# EAGLE design HWProgUSB_DIP (EAGLE 6.3)
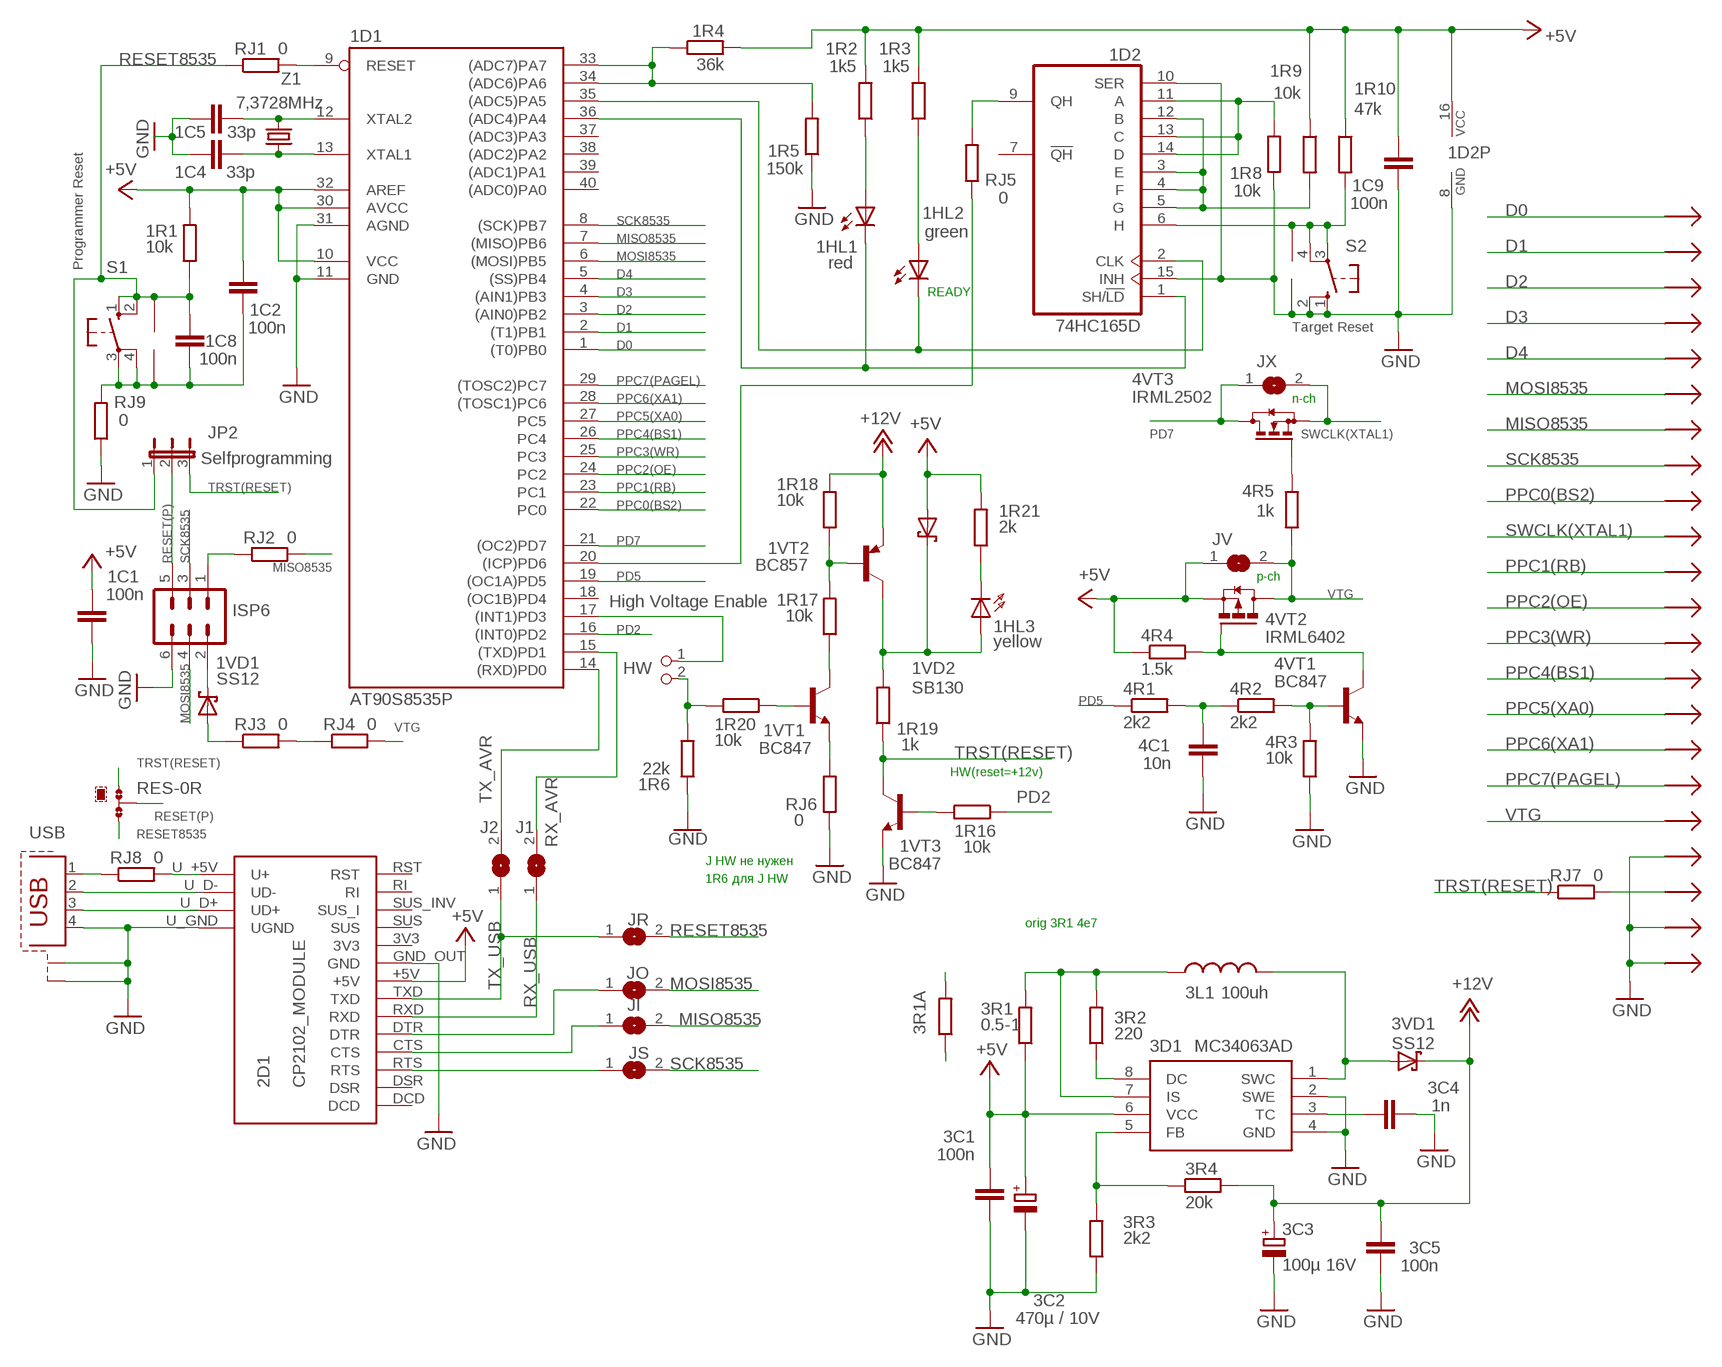
[diagram p0: schematic, sheet 1]

## Parts
1C1  100n  C-EUC0805  [C0805]
1C2  100n  C-EUC0805  [C0805]
1C4  33p  C-EUC0805  [C0805]
1C5  33p  C-EUC0805  [C0805]
1C8  100n  C-EUC0805  [C0805]
1C9  100n  C-EUC0805  [C0805]
1D1  AT90S8535P  [DIL40]
1D2  74HC165D  [SO16]
1HL1  red  LED5MM  [LED5MM]
1HL2  green  LED5MM  [LED5MM]
1HL3  yellow  LED5MM  [LED5MM]
1R1  10k  R-EU_M0805  [M0805]
1R2  1k5  R-EU_M0805  [M0805]
1R3  1k5  R-EU_M0805  [M0805]
1R4  36k  R-EU_M0805  [M0805]
1R5  150k  R-EU_R1206W  [R1206W]
1R6  22k  R-EU_M1206  [M1206]
1R8  10k  R-EU_M0805  [M0805]
1R9  10k  R-EU_R1206W  [R1206W]
1R10  47k  R-EU_M0805  [M0805]
1R16  10k  R-EU_R0805  [R0805]
1R17  10k  R-EU_M0805  [M0805]
1R18  10k  R-EU_M0805  [M0805]
1R19  1k  R-EU_M0805  [M0805]
1R20  10k  R-EU_M0805  [M0805]
1R21  2k  R-EU_R1206W  [R1206W]
1VD1  SS12  SCHOTTKY-DIODESMD  [SMB]
1VD2  SB130  SCHOTTKY-DIODESMD  [SMB]
1VT1  BC847  [SOT23]
1VT2  BC857  BC857A-PNP-SOT23-BEC  [SOT23-BEC]
1VT3  BC847  [SOT23]
2D1  CP2102_MODULE  [CP2102_MODULE]
3C1  100n  C-EU025-024X044  [C025-024X044]
3C2  470µ / 10V  RCL_CPOL-EUE3.5-8  [RCL_E3,5-8]
3C3  100µ 16V  RCL_CPOL-EUE3.5-8  [RCL_E3,5-8]
3C4  1n  C-EU025-025X050  [C025-025X050]
3C5  100n  C-EU025-025X050  [C025-025X050]
3D1  MC34063AD  [SOIC8]
3L1  100uh  L-US0207/10  [0207/10]
3R1  0.5-1  R-EU_0204/7  [0204/7]
3R1A  R-EU_0204/7  [0204/7]
3R2  220  R-EU_0204/7  [0204/7]
3R3  2k2  R-EU_M0805  [M0805]
3R4  20k  R-EU_M0805  [M0805]
3VD1  SS12  SCHOTTKY-DIODESMD  [SMB]
4C1  10n  C-EUC1206  [C1206]
4R1  2k2  R-EU_R1206W  [R1206W]
4R2  2k2  R-EU_M0805  [M0805]
4R3  10k  R-EU_M0805  [M0805]
4R4  1.5k  R-EU_M0805  [M0805]
4R5  1k  R-EU_M0805  [M0805]
4VT1  BC847  [SOT23]
4VT2  IRML6402  FDN360P  [SUPER-SOT3]
4VT3  IRML2502  BSS123  [SOT23]
HW  High Voltage Enable  PINHEAD_PINHD-1X2  [PINHEAD_1X02]
ISP6  MA03-2  [MA03-2]
J1  SJ  [SJ]
J2  SJ  [SJ]
JI  SJ  [SJ]
JO  SJ  [SJ]
JP2  Selfprogramming  JUMPER_JP2E  [JUMPER_JP2]
JR  SJ  [SJ]
JS  SJ  [SJ]
JV  SJ  [SJ]
JX  SJ  [SJ]
RES  0R-JUMPA  [A0R-JMP]
RJ1  0  R-EU_R1206  [R1206]
RJ2  0  R-EU_R1206  [R1206]
RJ3  0  R-EU_R1206  [R1206]
RJ4  0  R-EU_R1206  [R1206]
RJ5  0  R-EU_R1206W  [R1206W]
RJ6  0  R-EU_R1206  [R1206]
RJ7  0  R-EU_R1206  [R1206]
RJ8  0  R-EU_R1206  [R1206]
RJ9  0  R-EU_R1206  [R1206]
S1  10-XX  [B3F-10XX]
S2  10-XX  [B3F-10XX]
U$1  5.08  [KEY]
U$2  5.08  [KEY]
USB  PROGRAMMER_PN61729-S  [PROGRAMMER_PN61729-S]
X2  P_AVR_V  [CON-PCI]
Z1  7,3728MHz  CRYTALHC49U-V  [HC49U-V]

## Nets
+5V: 1C1.2 1C2.2 1C9.1 1D1.10(VCC) 1D1.30(AVCC) 1D1.32(AREF) 1D2.16(VCC) 1R1.2 1R2.2 1R3.2 1R4.2 1R9.1 1R10.1 1R21.2 1VD2.A 2D1.+5V 3C1.1 3C2.+ 3D1.6(VCC) 3R1.1 3R1A.1 4R4.1 4VT2.2(S) JV.1
+12V: 1R18.2 1VT2.E 3C3.+ 3C5.2 3R4.2 3VD1.C
D0: 1D1.1((T0)PB0) X2.1D0(D0) X2.2D0(D0)
D1: 1D1.2((T1)PB1) X2.1D1(D1) X2.2D1(D1)
D2: 1D1.3((AIN0)PB2) X2.1D2(D2) X2.2D2(D2)
D3: 1D1.4((AIN1)PB3) X2.1D3(D3) X2.2D3(D3)
D4: 1D1.5((SS)PB4) X2.1D4(D4) X2.2D4(D4)
GND: 1C1.1 1C4.1 1C5.1 1C9.2 1D1.31(AGND) 1D2.8(GND) 1D2.10(SER) 1D2.15(INH) 1R5.1 1R6.1 1R8.1 1VT3.2(E) 2D1.GND_OUT(GND) 2D1.U_GND(UGND) 3C1.2 3C2.- 3C3.- 3C4.2 3C5.1 3D1.2(SWE) 3D1.4(GND) 3R3.1 4C1.1 4R3.1 4VT1.2(E) ISP6.6 RJ6.1 RJ9.1 S2.1(S) S2.2(S1) U$2.P$1 USB.4 USB.S1 USB.S2 X2.0(GND) X2.1(GND) X2.1GND1(GND2) X2.1GND2(LGND) X2.2(GND) X2.2GND1(GND2) X2.2GND2(LGND) X2.3(GND) X2.4(GND) X2.5(GND) X2.6(GND) X2.7(GND) X2.8(GND) X2.9(GND) X2.10(GND) X2.11(GND) X2.12(GND) X2.13(GND) X2.14(GND) X2.15(GND) X2.16(GND) X2.17(GND) X2.18(GND) X2.19(GND) X2.20(GND) X2.21(GND) X2.22(GND) X2.23(GND) X2.24(GND) X2.25(GND) X2.26(GND) X2.27(GND) X2.28(GND) X2.29(GND) X2.30(GND) X2.31(GND) X2.32(GND) X2.33(GND) X2.34(GND) X2.35(GND) X2.36(GND) X2.37(GND) X2.38(GND) X2.39(GND) X2.40(GND) X2.41(GND)
MISO8535: 1D1.7((MISO)PB6) JI.2 RJ2.2 X2.1D6(D6) X2.2D6(D6)
MOSI8535: 1D1.6((MOSI)PB5) ISP6.4 JO.2 X2.1D5(D5) X2.2D5(D5)
N4: 1D1.36((ADC4)PA4) 1D2.1(SH/!LD) 1HL1.K(C)
N$1: RJ7.2 X2.1RESET(RESET) X2.2RESET(RESET)
N$2: 1D1.9(RESET) RJ1.2
N$3: ISP6.1 RJ2.1
N$4: 2D1.U_+5V(U+) RJ8.2
N$5: 1VT1.2(E) RJ6.2
N$6: 1VD1.C ISP6.2
N$7: 2D1.CTS JI.1
N$9: 1VD1.A RJ3.1
N$10: RJ3.2 RJ4.1
N$12: 1C5.2 1D1.12(XTAL2) Z1.2
N$13: 1C4.2 1D1.13(XTAL1) Z1.1
N$14: RJ8.1 USB.1
N$15: 1C2.1 1C8.1 RJ9.2 S1.3(P) S1.4(P1) U$1.P$1
N$20: 1HL3.K(C) 1R21.1
N$21: 4R5.2 4VT3.1(G)
N$22: 1D2.9(QH) RJ5.2
N$45: 2D1.U_D+(UD+) USB.3
N$46: 2D1.U_D-(UD-) USB.2
N$55: 4R2.2 4R3.2 4VT1.1(B)
N$59: 4R4.2 4VT1.3(C) 4VT2.1(G)
N$60: 2D1.RTS JS.1
N$62: 4C1.2 4R1.2 4R2.1
N$69: 2D1.DTR JO.1
N$104: 3D1.8(DC) 3R2.1
N$105: 3D1.7(IS) 3L1.1 3R1.2 3R1A.2 3R2.2
N$106: 3D1.5(FB) 3R3.2 3R4.1
N$107: 3D1.1(SWC) 3L1.2 3VD1.A
N$108: 3C4.1 3D1.3(TC)
N$122: 1HL2.A 1R3.1
N$123: 1D1.33((ADC7)PA7) 1D1.34((ADC6)PA6) 1R4.1 1R5.2
N$124: 1D1.35((ADC5)PA5) 1D2.2(CLK) 1HL2.K(C)
N$125: 1D2.6(H) 1R10.2 S2.3(P) S2.4(P1) U$2.P$2
N$131: 1D1.17((INT1)PD3) HW.1
N$132: 1R6.2 1R20.2 HW.2
N$133: 1HL3.A 1R19.2 1VD2.C 1VT2.C
N$134: 1R20.1 1VT1.1(B)
N$135: 1R17.1 1VT1.3(C)
N$136: 1R17.2 1R18.1 1VT2.B
N$137: 1D1.20((ICP)PD6) RJ5.1
N$138: 1HL1.A 1R2.1
N$139: 1D2.11(A) 1D2.13(C) 1D2.14(D) 1R8.2
N$140: 1D2.3(E) 1D2.4(F) 1D2.5(G) 1D2.12(B) 1R9.2
N$141: 1R16.2 1VT3.1(B)
PD2: 1D1.16((INT0)PD2) 1R16.1
PD5: 1D1.19((OC1A)PD5) 4R1.1
PD7: 1D1.21((OC2)PD7) 4VT3.3(D) JX.1
PPC0(BS2): 1D1.22(PC0) X2.1BS2(BS2) X2.2BS2(BS2)
PPC1(RB): 1D1.23(PC1) X2.1RB(RB) X2.2RB(RB)
PPC2(OE): 1D1.24(PC2) X2.1OE(OE) X2.2OE(OE)
PPC3(WR): 1D1.25(PC3) X2.1WR(WR) X2.2WR(WR)
PPC4(BS1): 1D1.26(PC4) X2.1BS1(BS1) X2.2BS1(BS1)
PPC5(XA0): 1D1.27(PC5) X2.1XA0(XA0) X2.2XA0(XA0)
PPC6(XA1): 1D1.28((TOSC1)PC6) X2.1XA1(XA1) X2.2XA1(XA1)
PPC7(PAGEL): 1D1.29((TOSC2)PC7) X2.1PAGEL(PAGEL) X2.2PAGEL(PAGEL)
RESET8535: 1C8.2 1R1.1 JP2.1 JR.2 RES.3 RJ1.1 S1.1(S) S1.2(S1) U$1.P$2
RESET(P): ISP6.5 JP2.2 RES.2
RX_AVR: 1D1.15((TXD)PD1) J1.2
RX_USB: 2D1.RXD J1.1
SCK8535: 1D1.8((SCK)PB7) ISP6.3 JS.2 X2.1D7(D7) X2.2D7(D7)
SWCLK(XTAL1): 4VT3.2(S) JX.2 X2.1XTAL1(XTAL1) X2.2XTAL1(XTAL1)
TRST(RESET): 1R19.1 1VT3.3(C) JP2.3 RES.1 RJ7.1
TX_AVR: 1D1.14((RXD)PD0) J2.2
TX_USB: 2D1.TXD J2.1 JR.1
VTG: 4R5.1 4VT2.3(D) JV.2 RJ4.2 X2.1VCC1(VCC) X2.2VCC1(VCC)
Unconnected: 1D1.18((OC1B)PD4) 1D1.37((ADC3)PA3) 1D1.38((ADC2)PA2) 1D1.39((ADC1)PA1) 1D1.40((ADC0)PA0) 1D2.7(!QH) 2D1.3V3 2D1.DCD 2D1.DSR 2D1.RI 2D1.RST 2D1.SUS 2D1.SUS_INV(SUS_I)

## Notes on the sheet
- Programmer Reset
- READY
- Target Reset
- n-ch
- p-ch
- HW(reset=+12v)
- J HW не нужен
- 1R6 для J HW
- orig 3R1 4e7

## Power pins joined to a net without a drawn wire
GND: 1D1.11(GND)

## Library data of the parts
1C1 1C2 1C4 1C5 1C8 1C9 3C4 3C5 4C1 = rcl:C-EU: CAPACITOR, European symbol
1D1 = atmel:AT90*8535P: MICROCONTROLLER 8 Kbytes FLASH 512 bytes SRAM 512 bytes EEPROM UART 8-channel 10 bit ADC; OC_FARNELL: unknown; OC_NEWARK: unknown
1D2 = 74xx-eu:74*165: 8-bit parallel load SHIFT REGISTER
1HL1 1HL2 = led:LED: LED OSRAM: - CHIPLED LG R971, LG N971, LY N971, LG Q971, LY Q971, LO R971, LY R971 LH N974, LH R974 LS Q976, LO Q976, LY Q976 LO Q996 - Hyper CHIPLED LW Q18S LB Q993, LB Q99A, LB R99A - SideLED LS A670, LO A670, LY A670, LG A670, LP A670 LB A673, LV A673, LT A673, LW A673 LH A674 LY A675 LS A676, LA A676, LO A676, LY A676, LW A676 LS A679, LY A679, LG A679 - Hyper Micro SIDELED® LS Y876, LA Y876, LO Y876, LY Y876 LT Y87S - SmartLED LW L88C, LW L88S LB L89C, LB L89S, LG L890 LS L89K, LO L89K, LY L89K LS L896, LA L896, LO L896, LY L896 - TOPLED LS T670, LO T670, LY T670, LG T670, LP T670 LSG T670, LSP T670, LSY T670, LOP T670, LYG T670 LG T671, LOG T671, LSG T671 LB T673, LV T673, LT T673, LW T673 LH T674 LS T676, LA T676, LO T676, LY T676, LB T676, LH T676, LSB T676, LW T676 LB T67C, LV T67C, LT T67C, LS T67K, LO T67K, LY T67K, LW E67C LS E67B, LA E67B, LO E67B, LY E67B, LB E67C, LV E67C, LT E67C LW T67C LS T679, LY T679, LG T679 LS T770, LO T770, LY T770, LG T770, LP T770 LB T773, LV T773, LT T773, LW T773 LH T774 LS E675, LA E675, LY E675, LS T675 LS T776, LA T776, LO T776, LY T776, LB T776 LHGB T686 LT T68C, LB T68C - Hyper Mini TOPLED® LB M676 - Mini TOPLED Santana® LG M470 LS M47K, LO M47K, LY M47K Source: http://www.osram.convergy.de/
1HL3 = rc-elektronik:LED: LED OSRAM: - CHIPLED LG R971, LG N971, LY N971, LG Q971, LY Q971, LO R971, LY R971 LH N974, LH R974 LS Q976, LO Q976, LY Q976 LO Q996 - Hyper CHIPLED LW Q18S LB Q993, LB Q99A, LB R99A - SideLED LS A670, LO A670, LY A670, LG A670, LP A670 LB A673, LV A673, LT A673, LW A673 LH A674 LY A675 LS A676, LA A676, LO A676, LY A676, LW A676 LS A679, LY A679, LG A679 - Hyper Micro SIDELED® LS Y876, LA Y876, LO Y876, LY Y876 LT Y87S - SmartLED LW L88C, LW L88S LB L89C, LB L89S, LG L890 LS L89K, LO L89K, LY L89K LS L896, LA L896, LO L896, LY L896 - TOPLED LS T670, LO T670, LY T670, LG T670, LP T670 LSG T670, LSP T670, LSY T670, LOP T670, LYG T670 LG T671, LOG T671, LSG T671 LB T673, LV T673, LT T673, LW T673 LH T674 LS T676, LA T676, LO T676, LY T676, LB T676, LH T676, LSB T676, LW T676 LB T67C, LV T67C, LT T67C, LS T67K, LO T67K, LY T67K, LW E67C LS E67B, LA E67B, LO E67B, LY E67B, LB E67C, LV E67C, LT E67C LW T67C LS T679, LY T679, LG T679 LS T770, LO T770, LY T770, LG T770, LP T770 LB T773, LV T773, LT T773, LW T773 LH T774 LS E675, LA E675, LY E675, LS T675 LS T776, LA T776, LO T776, LY T776, LB T776 LHGB T686 LT T68C, LB T68C - Hyper Mini TOPLED® LB M676 - Mini TOPLED Santana® LG M470 LS M47K, LO M47K, LY M47K Source: http://www.osram.convergy.de/
1R1-1R6 1R8-1R10 1R16-1R21 3R1 3R1A 3R2-3R4 4R1-4R5 RJ1-RJ9 = rcl:R-EU_: RESISTOR, European symbol
1VD1 1VD2 3VD1 = diode:SCHOTTKY-DIODE: Schottky Diode
1VT1 1VT3 = transistor:BC847: NPN TRANSISTOR
1VT2 = transistor:*-PNP-: PNP Transistror
2D1 = HWProgUSB_DIP:CP2102_MODULE
3C1 = rc-elektronik:C-EU: CAPACITOR, European symbol
3C2 3C3 = HWProgUSB:RCL_CPOL-EU: POLARIZED CAPACITOR, European symbol
3D1 = mc34063:MC34063
3L1 = rcl:L-US: INDUCTOR, American symbol
4VT1 = transistor-neu-to92:BC847: NPN TRANSISTOR
4VT2 = transistor-power:FDN360P: Single P-Channel, PowerTrench (R) MOSFET Source: http://www.fairchildsemi.com/ds/FD/FDN360P.pdf
4VT3 = transistor-small-signal:BSS123: N-CHANNEL MOS FET
HW = HWProgUSB:PINHEAD_PINHD-1X2: PIN HEADER
ISP6 = con-lstb:MA03-2: PIN HEADER
J1 J2 JI JO JR JS JV JX = jumper:SJ: SMD solder JUMPER
JP2 = HWProgUSB:JUMPER_JP2E: JUMPER
RES = jump-0r-smd:0R-JUMP: SMD 0R 0805 Jumper
S1 S2 = switch-omron:10-XX: OMRON SWITCH
U$1 U$2 = Programmer:5.08
USB = HWProgUSB:PROGRAMMER_PN61729-S: BERG USB connector
X2 = HWProgUSB_DIP:P_AVR_V
Z1 = crystal:CRYTAL: CRYSTAL

## Board
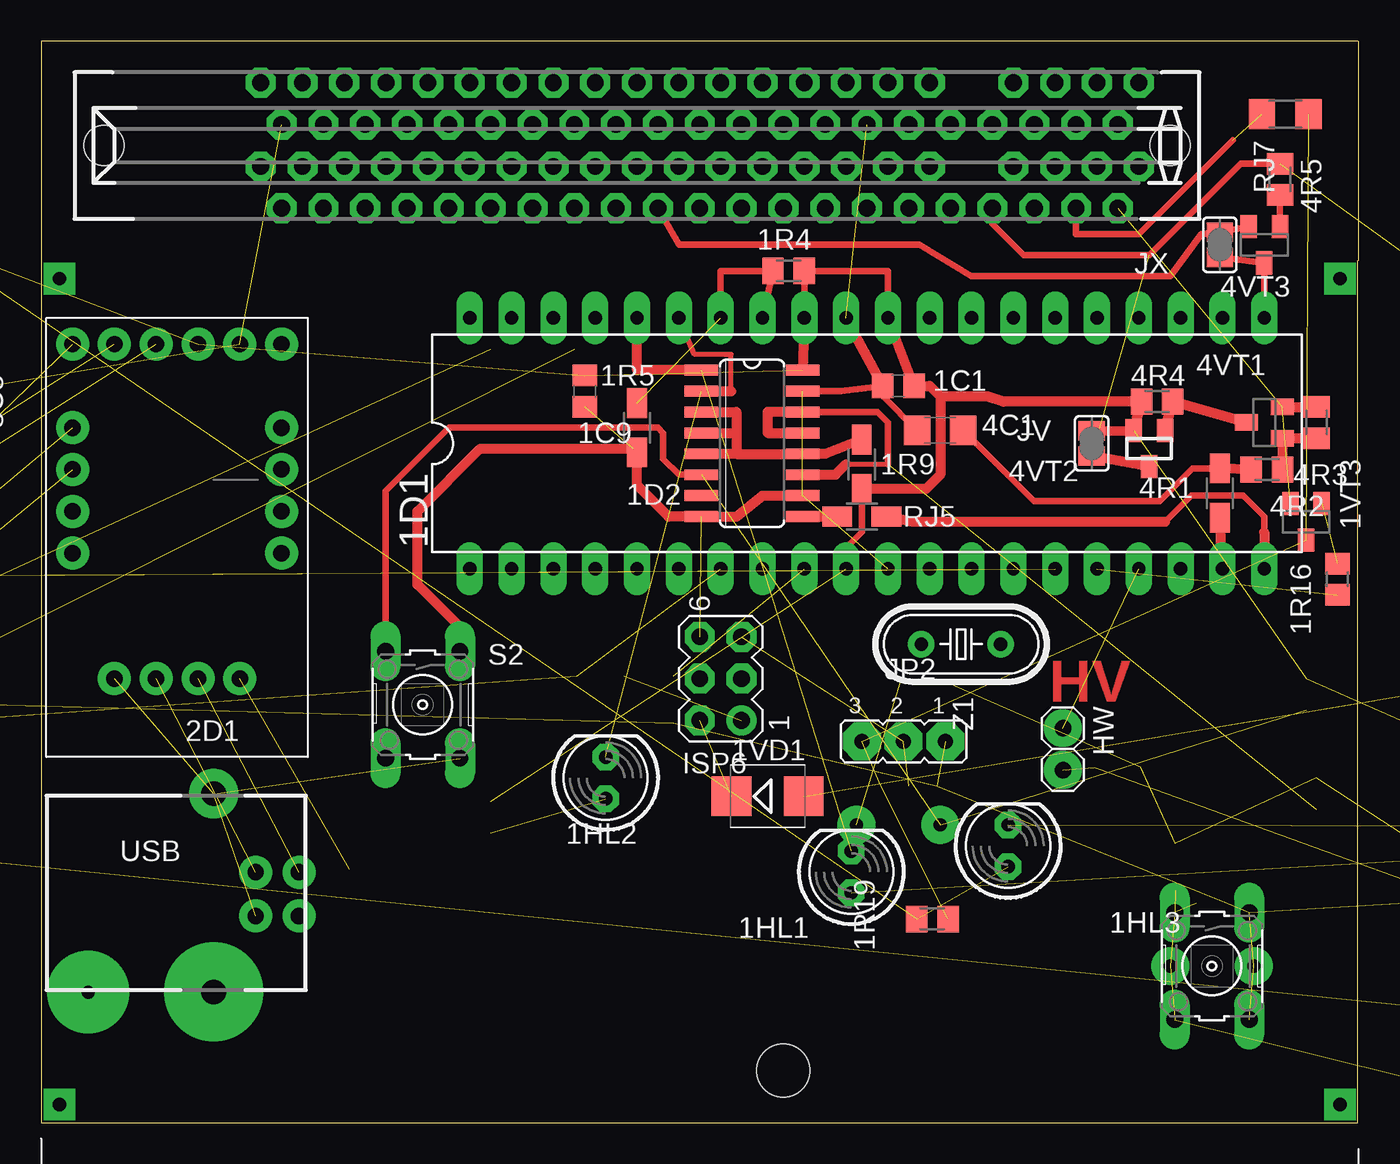
[diagram p1: board, top side]
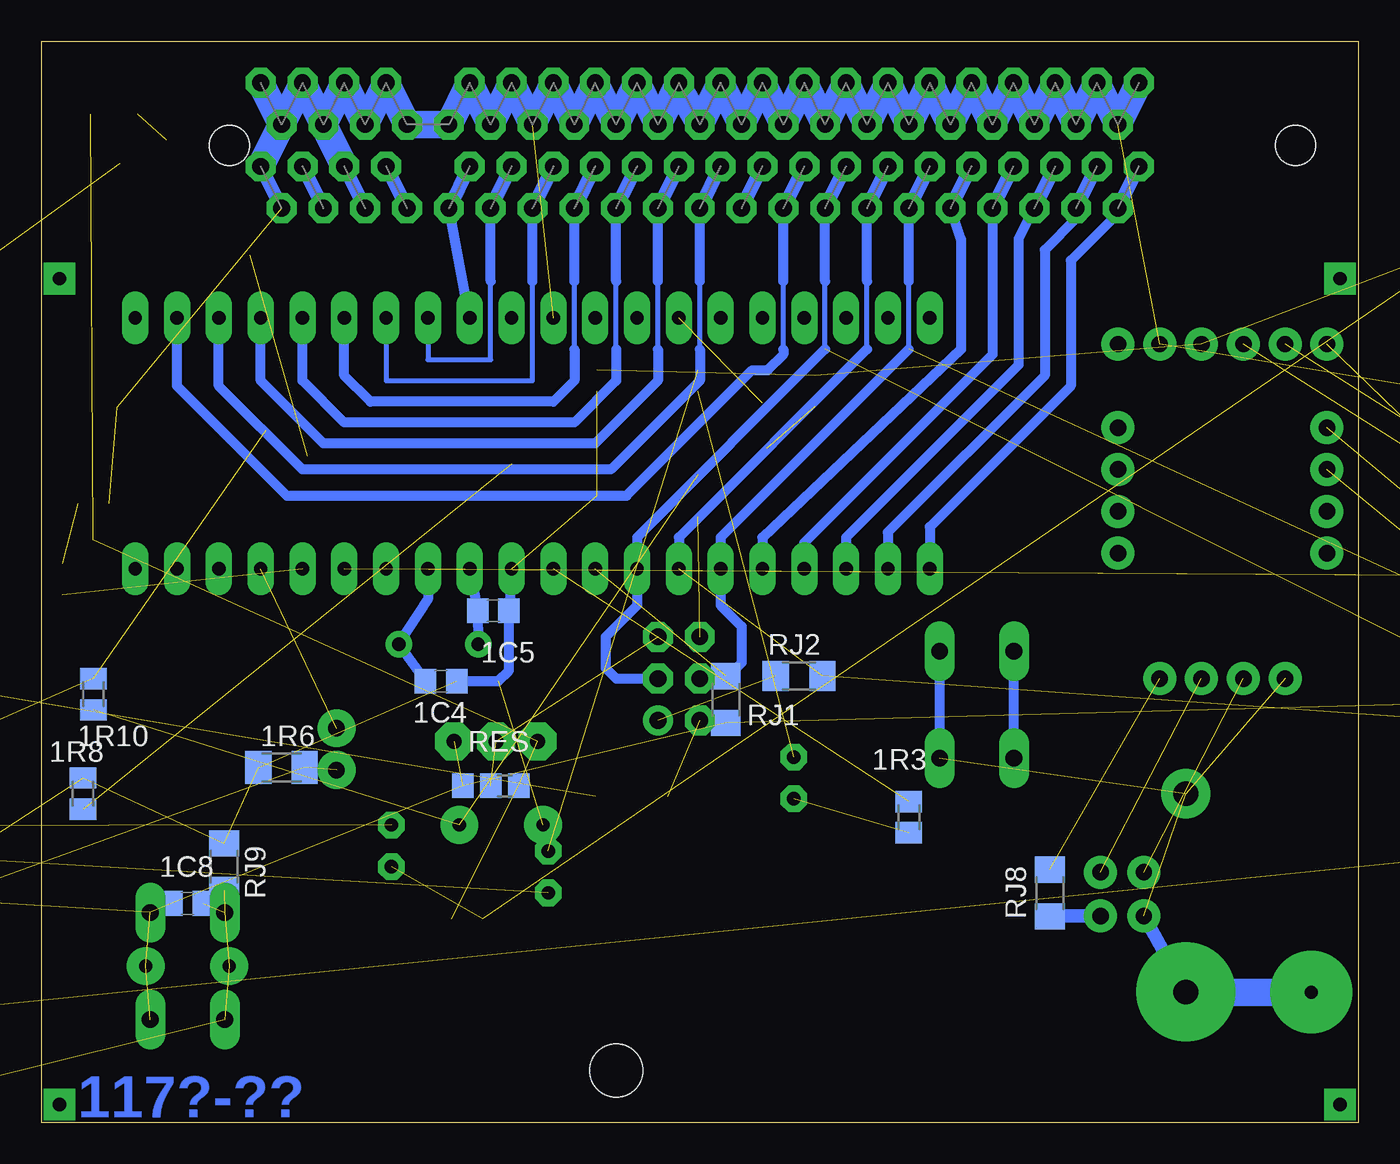
[diagram p2: board, bottom side, seen from below]

Size 80.01 x 65.71 mm. Coordinates in mm from the lower left corner, seen from the top.
Outline: 79.99,52.38 79.99,0 0,0 0,65.71 79.99,65.71
Outline: 80.01,65.71 80.01,52.38
Copper layers (1*16): Top 0.035mm / dielectric 1.5mm / Bottom 0.035mm
Design rules "DesignRules": minimum track width 8mil, minimum drill 24mil, track to track 0.2mm, track to pad 0.2mm, pad to pad 8mil, via to via 8mil, smd to smd 8mil, copper to edge 10mil, drill to drill 8mil, minimum pad ring 0.4mm, minimum via ring 8mil, stop-mask expansion 4mil, vias tented up to drill 0mil, thermal gap 10mil
Holes 3.2 mm at 45.09,3.17

### Footprints (pad centres in the part's own frame; a part is rotated, then mirrored left to right if it is on the bottom)
C0805 = smd 1.3 x 1.5: 1 -0.95,0; 2 0.95,0
DIL40 = drill 0.813 long: 1 -24.13,-7.62; 2 -21.59,-7.62; 3 -19.05,-7.62; 4 -16.51,-7.62; 5 -13.97,-7.62; 6 -11.43,-7.62; 7 -8.89,-7.62; 8 -6.35,-7.62; 9 -3.81,-7.62; 10 -1.27,-7.62; 11 1.27,-7.62; 12 3.81,-7.62; 13 6.35,-7.62; 14 8.89,-7.62; 15 11.43,-7.62; 16 13.97,-7.62; 17 16.51,-7.62; 18 19.05,-7.62; 19 21.59,-7.62; 20 24.13,-7.62; 21 24.13,7.62; 22 21.59,7.62; 23 19.05,7.62; 24 16.51,7.62; 25 13.97,7.62; 26 11.43,7.62; 27 8.89,7.62; 28 6.35,7.62; 29 3.81,7.62; 30 1.27,7.62; 31 -1.27,7.62; 32 -3.81,7.62; 33 -6.35,7.62; 34 -8.89,7.62; 35 -11.43,7.62; 36 -13.97,7.62; 37 -16.51,7.62; 38 -19.05,7.62; 39 -21.59,7.62; 40 -24.13,7.62
SO16 = smd 0.66 x 2.032: 1 -4.445,-3.073; 2 -3.175,-3.073; 3 -1.905,-3.073; 4 -0.635,-3.073; 5 0.635,-3.073; 6 1.905,-3.073; 7 3.175,-3.073; 8 4.445,-3.073; 9 4.445,3.073; 10 3.175,3.073; 11 1.905,3.073; 12 0.635,3.073; 13 -0.635,3.073; 14 -1.905,3.073; 15 -3.175,3.073; 16 -4.445,3.073
LED5MM = drill 0.813 octagon: A -1.27,0; K 1.27,0
M0805 = smd 1.3 x 1.6: 1 -0.95,0; 2 0.95,0
R1206W = smd 1.8 x 1.2: 1 -1.499,0; 2 1.499,0
M1206 = smd 1.6 x 2: 1 -1.4,0; 2 1.4,0
R0805 = smd 1.3 x 1.5: 1 -0.95,0; 2 0.95,0
SMB = smd 2.4 x 2.4: A 2.2,0; C -2.2,0
SOT23 = smd 1 x 1.4: 1 -0.95,-1.1; 2 0.95,-1.1; 3 0,1.1
SOT23-BEC = smd 1 x 1.4: B -0.95,-1.1; C 0,1.1; E 0.95,-1.1
CP2102_MODULE = drill 1 pad 2: 3V3 -6.35,-8.89; +5V -1.27,-8.89; CTS 6.35,-3.81; DCD 6.35,3.81; DSR 6.35,1.27; DTR 6.35,-8.89; GND_OUT -3.81,-8.89; RI -6.35,1.27; RST -6.35,3.81; RTS 6.35,-1.27; RXD 3.81,-8.89; SUS -6.35,-3.81; SUS_INV -6.35,-1.27; TXD 1.27,-8.89; U_+5V -3.81,11.43; U_D+ 1.27,11.43; U_D- -1.27,11.43; U_GND 3.81,11.43
C025-024X044 = drill 0.813 octagon: 1 -1.27,0; 2 1.27,0
RCL_E3,5-8 = drill 0.813 pad 3: + -1.778,0 | drill 0.813 pad 3 octagon: - 1.778,0
C025-025X050 = drill 0.813 octagon: 1 -1.27,0; 2 1.27,0
SOIC8 = smd 0.6 x 2.2: 1 -1.905,-2.6; 2 -0.635,-2.6; 3 0.635,-2.6; 4 1.905,-2.6; 5 1.905,2.6; 6 0.635,2.6; 7 -0.635,2.6; 8 -1.905,2.6
0207/10 = drill 0.813 octagon: 1 -5.08,0; 2 5.08,0
0204/7 = drill 0.813 octagon: 1 -3.81,0; 2 3.81,0
C1206 = smd 1.6 x 1.8: 1 -1.4,0; 2 1.4,0
SUPER-SOT3 = smd 1 x 1.4: 1 -0.95,-1.1; 2 0.95,-1.1; 3 0,1.1
PINHEAD_1X02 = drill 1.016 pad 2.3: 1 -1.27,0; 2 1.27,0
MA03-2 = drill 1.016: 1 -2.54,-1.27 | drill 1.016 octagon: 2 -2.54,1.27; 3 0,-1.27; 4 0,1.27; 5 2.54,-1.27; 6 2.54,1.27
SJ = smd 1.168 x 1.6: 1 -0.762,0; 2 0.762,0
JUMPER_JP2 = drill 0.914 pad 2.3 octagon: 1 -2.54,0; 2 0,0; 3 2.54,0
A0R-JMP = smd 1.5 x 1.3: 1 0,1.7; 2 0,0; 3 0,-1.7
R1206 = smd 1.6 x 1.803: 1 -1.422,0; 2 1.422,0
B3F-10XX = drill 1.016 long: 1 -3.251,2.261; 2 3.251,2.261; 3 -3.251,-2.261; 4 3.251,-2.261
KEY = drill 0.8 pad 2.3: P$1 -2.54,0.635; P$2 2.54,0.635
PROGRAMMER_PN61729-S = drill 1 pad 2: 1 1.409,5.186; 2 -1.25,5.186; 3 -1.25,2.551; 4 1.409,2.551 | drill 1.5 pad 3: S1 -6.02,0 | drill 1.5 pad 6: S2 6.02,0
CON-PCI = drill 1.016 pad 1.676 octagon: 0 -31.115,3.81; 1 -29.845,1.27; 1BS1 1.905,-1.27; 1BS2 -10.795,-1.27; 1D0 -31.115,-1.27; 1D1 -28.575,-1.27; 1D2 -26.035,-1.27; 1D3 -23.495,-1.27; 1D4 -20.955,-1.27; 1D5 -18.415,-1.27; 1D6 -15.875,-1.27; 1D7 -13.335,-1.27; 1GND1 17.145,-1.27; 1GND2 22.225,-1.27; 1OE -3.175,-1.27; 1PAGEL 9.525,-1.27; 1RB -5.715,-1.27; 1RESET 19.685,-1.27; 1VCC1 14.605,-1.27; 1WR -0.635,-1.27; 1XA0 4.445,-1.27; 1XA1 6.985,-1.27; 1XTAL1 -8.255,-1.27; 2 -28.575,3.81; 2BS1 3.175,-3.81; 2BS2 -9.525,-3.81; 2D0 -29.845,-3.81; 2D1 -27.305,-3.81; 2D2 -24.765,-3.81; 2D3 -22.225,-3.81; 2D4 -19.685,-3.81; 2D5 -17.145,-3.81; 2D6 -14.605,-3.81; 2D7 -12.065,-3.81; 2GND1 15.875,-3.81; 2GND2 20.955,-3.81; 2OE -1.905,-3.81; 2PAGEL 10.795,-3.81; 2RB -4.445,-3.81; 2RESET 18.415,-3.81; 2VCC1 13.335,-3.81; 2WR 0.635,-3.81; 2XA0 5.715,-3.81; 2XA1 8.255,-3.81; 2XTAL1 -6.985,-3.81; 3 -27.305,1.27; 4 -26.035,3.81; 5 -24.765,1.27; 6 -23.495,3.81; 7 -22.225,1.27; 8 -20.955,3.81; 9 -19.685,1.27; 10 -18.415,3.81; 11 -17.145,1.27; 12 -15.875,3.81; 13 -14.605,1.27; 14 -13.335,3.81; 15 -12.065,1.27; 16 -10.795,3.81; 17 -9.525,1.27; 18 -8.255,3.81; 19 -6.985,1.27; 20 -5.715,3.81; 21 -4.445,1.27; 22 -3.175,3.81; 23 -1.905,1.27; 24 -0.635,3.81; 25 0.635,1.27; 26 1.905,3.81; 27 3.175,1.27; 28 4.445,3.81; 29 5.715,1.27; 30 6.985,3.81; 31 8.255,1.27; 32 9.525,3.81; 33 10.795,1.27; 34 13.335,1.27; 35 14.605,3.81; 36 15.875,1.27; 37 17.145,3.81; 38 18.415,1.27; 39 19.685,3.81; 40 20.955,1.27; 41 22.225,3.81 | hole 2.438: 24.13,0; -40.64,0
HC49U-V = drill 0.813: 1 -2.413,0; 2 2.413,0

### Placement (x,y rotation side)
1C1  52.07,44.77 0 top
1C2  113.51,-5.08 0 bottom  (outside the outline)
1C4  55.72,26.83 180 bottom
1C5  52.55,31.11 180 bottom
1C8  71.12,13.34 180 bottom
1C9  33.02,44.45 270 top
1D1  50.16,41.27 0 top
1D2  43.18,41.27 270 top
1HL1  49.21,15.24 90 top
1HL2  34.29,20.95 90 top
1HL3  58.74,16.83 90 top
1R1  107.63,14.92 0 bottom  (outside the outline)
1R2  103.5,16.19 270 bottom  (outside the outline)
1R3  27.3,18.57 90 bottom
1R4  45.4,51.75 0 top
1R5  36.2,42.23 90 top
1R6  65.41,21.59 0 bottom
1R8  77.47,20 270 bottom
1R9  49.85,40.01 90 top
1R10  76.83,26.04 270 bottom
1R16  78.74,33.02 90 top
1R17  93.98,5.08 90 bottom  (outside the outline)
1R18  -22.86,17.78 0 bottom  (outside the outline)
1R19  54.13,12.38 180 top
1R20  109.54,4.13 90 bottom  (outside the outline)
1R21  110.33,16.51 270 bottom  (outside the outline)
1VD1  44.13,19.84 0 top
1VD2  -14.92,57.47 180 top  (outside the outline)
1VT1  108.58,0.79 270 bottom  (outside the outline)
1VT2  -27.62,24.61 0 bottom  (outside the outline)
1VT3  76.83,36.51 180 top
2D1  8.26,38.42 180 top
3C1  -33.34,52.86 0 top  (outside the outline)
3C2  -34.45,45.72 90 top  (outside the outline)
3C3  -11.11,45.72 90 top  (outside the outline)
3C4  -19.37,42.86 90 top  (outside the outline)
3C5  -5.08,43.18 270 top  (outside the outline)
3D1  -24.77,42.55 270 bottom  (outside the outline)
3L1  -24.45,48.58 0 top  (outside the outline)
3R1  -30.48,37.15 0 top  (outside the outline)
3R1A  -30.48,34.77 0 top  (outside the outline)
3R2  -27.46,42.23 270 top  (outside the outline)
3R3  -18.73,36.2 0 bottom  (outside the outline)
3R4  -13.97,36.2 180 bottom  (outside the outline)
3VD1  -16.19,44.77 90 bottom  (outside the outline)
4C1  54.61,42.07 0 top
4R1  71.6,38.26 90 top
4R2  74.45,39.69 0 top
4R3  77.47,42.55 270 top
4R4  67.79,43.81 0 top
4R5  75.25,57.31 270 top
4VT1  74.3,42.55 90 top
4VT2  67.31,40.96 180 top
4VT3  74.3,53.34 180 top
HW  62.07,22.7 270 top
ISP6  41.27,26.99 90 top
J1  -20.32,32.38 90 bottom  (outside the outline)
J2  -17.78,32.38 90 bottom  (outside the outline)
JI  -19.68,23.5 180 bottom  (outside the outline)
JO  -19.68,25.72 180 bottom  (outside the outline)
JP2  52.39,23.18 180 top
JR  -15.24,25.72 180 bottom  (outside the outline)
JS  -19.68,21.27 180 bottom  (outside the outline)
JV  63.82,41.27 270 top
JX  71.6,53.34 90 top
RES  52.7,20.48 270 bottom
RJ1  38.42,25.72 90 bottom
RJ2  33.97,27.15 0 bottom
RJ3  87.47,26.51 0 top  (outside the outline)
RJ4  98.27,40.64 0 top  (outside the outline)
RJ5  49.85,36.83 180 top
RJ6  111.12,-1.91 0 bottom  (outside the outline)
RJ7  75.56,61.28 180 top
RJ8  18.73,13.97 90 bottom
RJ9  68.9,15.56 270 bottom
S1  71.12,9.53 270 top
S2  23.18,25.4 270 top
U$1  71.12,8.89 0 top
U$2  52.07,17.46 0 top
USB  10.48,13.97 270 top
X2  44.45,59.37 0 top
Z1  55.88,29.08 180 top

### Tracks (layer width: path | path; a pad name or v marks a point on that pad's centre or on a via)
+5V  (14 unrouted)
  Top 0.406: 1D1.32 1R4.2 51.44,51.75 1D1.30 | 1R9.1 49.85,35.88 48.9,34.92 1D1.10
  Top 0.61: 1D1.30 1C1.2 53.97,44.77 54.61,44.13 | 54.61,44.13 54.61,39.37 53.75,38.51 1R9.1 | 1D1.32 1D2.16 | 54.61,44.13 57.47,44.13 58.42,43.81 4R4.1 4VT2.2 JV.1
+12V  (5 unrouted)
D0
  Bottom 0.61: X2.2D0 14.61,55.24 17.46,52.39 17.46,44.77 26.04,36.2 1D1.1
  Bottom 0.813: X2.1D0 X2.2D0
D1
  Bottom 0.61: X2.2D1 17.14,54.93 19.05,53.02 19.05,45.4 28.57,35.88 1D1.2
  Bottom 0.813: X2.1D1 X2.2D1
D2
  Bottom 0.61: 31.11,34.92 1D1.3 31.11,35.56 20.64,46.04 20.64,53.66 19.37,56.2
  Bottom 0.813: X2.1D2 19.37,56.2 X2.2D2
D3
  Bottom 0.305: 1D1.4 33.66,34.92
  Bottom 0.61: X2.2D3 22.23,46.67 33.66,35.24 1D1.4
  Bottom 0.813: X2.1D3 X2.2D3
D4
  Bottom 0.305: 1D1.5 36.2,34.92
  Bottom 0.61: 1D1.5 36.2,35.56 24.13,46.99 24.13,53.66 X2.2D4
  Bottom 0.813: X2.1D4 X2.2D4
GND  (24 unrouted)
  Top 0.406: 1D2.15 48.58,44.45 1C1.1 51.12,44.16 4C1.1 | 77.15,43.81 4R3.1
  Top 0.61: 1C1.1 1D1.31 | 1D2.10 43.81,38.1 42.23,36.83 1D2.8 38.1,36.83 36.2,38.73 1R5.1 35.97,40.96 26.67,40.96 22.86,37.15 22.86,32.7 25.44,30.12 S2.1 | 4VT1.2 4R3.1
  Bottom 0.61: 1D1.11 1C5.1 51.6,27.46 52.23,26.83 1C4.1 | S2.1 S2.2
  Bottom 0.813: X2.1GND1 X2.2GND1 | X2.1GND2 X2.2GND2 | USB.4 USB.S2
  Bottom 1.676: X2.0 X2.1 X2.2 X2.3 X2.4 X2.5 X2.6 X2.7 X2.8 X2.9 X2.10 X2.11 X2.12 X2.13 X2.14 X2.15 X2.16 X2.17 X2.18 X2.19 X2.20 X2.21 41.27,62.87 X2.22 X2.23 X2.24 X2.25 X2.26 X2.27 X2.28 X2.29 X2.30 X2.31 X2.32 X2.33 X2.34 X2.35 X2.36 X2.37 X2.38 | X2.38 X2.39 X2.40 | X2.40 X2.41 | X2.40 X2.1GND2 | X2.38 X2.1GND1
MISO8535  (2 unrouted)
  Bottom 0.305: 1D1.7 41.27,34.92 | 29.84,46.99 29.84,51.12
  Bottom 0.61: 29.84,46.99 41.27,35.56 1D1.7 | 29.84,51.12 X2.2D6
  Bottom 0.813: X2.1D6 X2.2D6
MOSI8535  (1 unrouted)
  Bottom 0.305: 1D1.6 38.73,34.92 | 27.3,46.99 27.3,51.12
  Bottom 0.61: 27.3,46.99 38.73,35.56 1D1.6 38.73,31.43 37.47,30.16 37.47,27.94 38.42,26.99 ISP6.4 | 27.3,51.12 X2.2D5
  Bottom 0.813: X2.1D5 X2.2D5
N4  (1 unrouted)
  Top 0.61: 1D2.1 36.2,45.72 1D1.36
N$1  (1 unrouted)
  Top 0.406: X2.2RESET 62.87,53.98 66.67,53.98 72.39,59.69
  Bottom 0.813: X2.1RESET X2.2RESET
N$2  (1 unrouted)
N$3  (1 unrouted)
N$4  (1 unrouted)
N$5  (1 unrouted)
N$6  (1 unrouted)
N$7  (1 unrouted)
N$9  (1 unrouted)
N$10  (1 unrouted)
N$11  (via drill 0.8 pad 5)
  Bottom 1.676: v2.86,7.94 10.64,7.94
N$12
  Bottom 0.61: 1D1.12 1C5.2 Z1.2
N$13
  Bottom 0.61: 1C4.2 Z1.1 56.52,31.81 1D1.13
N$14
  Bottom 0.813: USB.1 RJ8.1
N$15  (5 unrouted)
N$16  (via drill 0.8 pad 1.93)
  other vias: 78.9,1.11
N$17  (via drill 0.8 pad 1.93)
  other vias: 1.11,1.11
N$18  (via drill 0.8 pad 1.93)
  other vias: 1.11,51.28
N$19  (via drill 0.8 pad 1.93)
  other vias: 78.9,51.28
N$20  (1 unrouted)
N$21
  Top 0.406: 4VT3.1 4R5.2
N$22
  Top 0.61: 1D2.9 RJ5.2
N$45  (1 unrouted)
N$46  (1 unrouted)
N$55
  Top 0.61: 4R3.2 4VT1.1 4R2.2
N$59
  Top 0.61: 4VT1.3 4R4.2 4VT2.1
N$60  (1 unrouted)
N$62
  Top 0.406: 4R1.2 69.92,39.76 67.94,37.78 60.3,37.78 4C1.2
  Top 0.61: 4R2.1 4R1.2
N$69  (1 unrouted)
N$104  (1 unrouted)
N$105  (4 unrouted)
N$106  (2 unrouted)
N$107  (2 unrouted)
N$108  (1 unrouted)
N$122  (1 unrouted)
N$123  (1 unrouted)
  Top 0.406: 1D1.33 1R4.1 41.27,51.75 1D1.34
N$124  (1 unrouted)
  Top 0.305: 41.91,44.45 41.91,46.67 39.69,46.67 1D1.35
  Top 0.61: 1D2.2 41.91,44.45
N$125  (2 unrouted)
  Top 0.406: 1D2.6 38.73,39.37 37.78,40.32 37.78,41.91 37.47,42.23 24.77,42.23 20.92,38.38 S2.3
  Bottom 0.61: S2.4 S2.3
N$131  (1 unrouted)
N$132  (2 unrouted)
N$133  (3 unrouted)
N$134  (1 unrouted)
N$135  (1 unrouted)
N$136  (2 unrouted)
N$137
  Top 0.406: 68.26,36.51 69.85,38.1 73.03,38.1 74.3,36.83 74.3,35.88
  Top 0.61: 74.3,35.88 1D1.20 | 68.26,36.51 52.93,36.51 RJ5.1
N$138  (1 unrouted)
N$139  (1 unrouted)
  Top 0.305: 48.9,40.01 51.44,40.01
  Top 0.406: 1D2.14 50.8,43.18 51.44,42.55 51.44,40.01
  Top 0.61: 1D2.14 44.13,43.18 44.13,41.91 1D2.13 | 1D2.11 48.26,39.37 48.9,40.01
N$140
  Top 0.61: 1D2.3 42.23,43.18 42.23,41.91 | 42.23,41.91 42.23,40.64 | 42.23,40.64 1D2.5 | 1D2.4 42.23,41.91 | 42.23,40.64 1D2.12 47.62,40.64 1R9.2
N$141  (1 unrouted)
PD2  (1 unrouted)
PD5
  Top 0.61: 1D1.19 4R1.1
PD7
  Top 0.406: 1D1.21 4VT3.3 JX.1
PPC0(BS2)
  Bottom 0.305: 34.92,46.99 34.92,51.12
  Bottom 0.61: 34.92,46.99 34.92,46.67 35.88,45.72 36.83,45.72 44.45,38.1 65.09,38.1 71.75,44.77 1D1.22 | 34.92,51.12 X2.2BS2
  Bottom 0.813: X2.1BS2 X2.2BS2
PPC1(RB)
  Bottom 0.305: 40.01,46.99 40.01,51.12
  Bottom 0.61: 40.01,46.99 40.01,45.09 45.4,39.69 64.14,39.69 69.22,44.77 1D1.23 | 40.01,51.12 X2.2RB
  Bottom 0.813: X2.1RB X2.2RB
PPC2(OE)
  Bottom 0.305: 42.55,46.99 42.55,51.12
  Bottom 0.61: 42.55,46.99 42.55,45.09 46.35,41.27 62.87,41.27 66.67,45.09 1D1.24 | 42.55,51.12 X2.2OE
  Bottom 0.813: X2.1OE X2.2OE
PPC3(WR)
  Bottom 0.305: 45.09,46.99 45.09,51.12
  Bottom 0.61: 45.09,46.99 45.09,45.09 47.62,42.55 61.59,42.55 64.14,45.09 1D1.25 | 45.09,51.12 X2.2WR
  Bottom 0.813: X2.1WR X2.2WR
PPC4(BS1)
  Bottom 0.305: 47.62,46.99 47.62,51.12
  Bottom 0.61: 47.62,46.99 47.62,45.09 48.9,43.81 60.01,43.81 61.59,45.4 1D1.26 | 47.62,51.12 X2.2BS1
  Bottom 0.813: X2.1BS1 X2.2BS1
PPC5(XA0)
  Bottom 0.305: 1D1.27 59.05,45.09 50.16,45.09 50.16,51.12
  Bottom 0.61: 50.16,51.12 X2.2XA0
  Bottom 0.813: X2.1XA0 X2.2XA0
PPC6(XA1)
  Bottom 0.305: 1D1.28 56.52,46.35 52.7,46.35 52.7,51.12
  Bottom 0.61: 52.7,51.12 X2.2XA1
  Bottom 0.813: X2.1XA1 X2.2XA1
PPC7(PAGEL)
  Bottom 0.61: 1D1.29 X2.2PAGEL
  Bottom 0.813: X2.1PAGEL X2.2PAGEL
RESET8535  (8 unrouted)
RESET(P)  (2 unrouted)
RX_AVR  (1 unrouted)
RX_USB  (1 unrouted)
SCK8535  (1 unrouted)
  Bottom 0.305: 32.38,46.99 32.38,51.12
  Bottom 0.61: 32.38,46.99 43.81,35.56 1D1.8 43.81,31.43 45.72,29.53 45.72,27.62 45.09,26.99 ISP6.3 | 32.38,51.12 X2.2D7
  Bottom 0.813: X2.1D7 X2.2D7
SWCLK(XTAL1)
  Top 0.406: X2.2XTAL1 38.73,53.34 53.34,53.34 56.52,51.44 68.58,51.44 70.48,53.98 JX.2 4VT3.2
  Bottom 0.813: X2.1XTAL1 X2.2XTAL1
TRST(RESET)  (4 unrouted)
TX_AVR  (1 unrouted)
TX_USB  (2 unrouted)
VTG  (2 unrouted)
  Top 0.406: X2.2VCC1 57.78,54.61 59.69,52.7 67.31,52.7 72.86,58.26 4R5.1
  Top 0.61: 4VT2.3 JV.2
  Bottom 0.813: X2.1VCC1 X2.2VCC1
(copper drawn outside any net)
  shapes: Top area x1

### Text on the board
Top: STK500 | HWPROG | USB-SP | 117?-?? | HV
Bottom: 117?-??
bJumper: 1
tJumper: T | P